# Altium schematic sheet [SH][SW20] V1.0.SchDoc
size A4; PageSetup: Record=PageOptions|CenterHorizontal=True|CenterVertical=True|PrintScale=0.91|XCorrection=1.00|YCorrection=1.00|PrintKind=1|BorderSize=5000000|LeftOffset=0|BottomOffset=0|Orientation=2|PaperLength=3530|PaperWidth=2500|Scale=100|PaperSource=7|PrintQuality=1200|MediaType=1|DitherType=10|PrintScaleMode=1|PaperKind=B4 (ISO)|PaperIndex=42
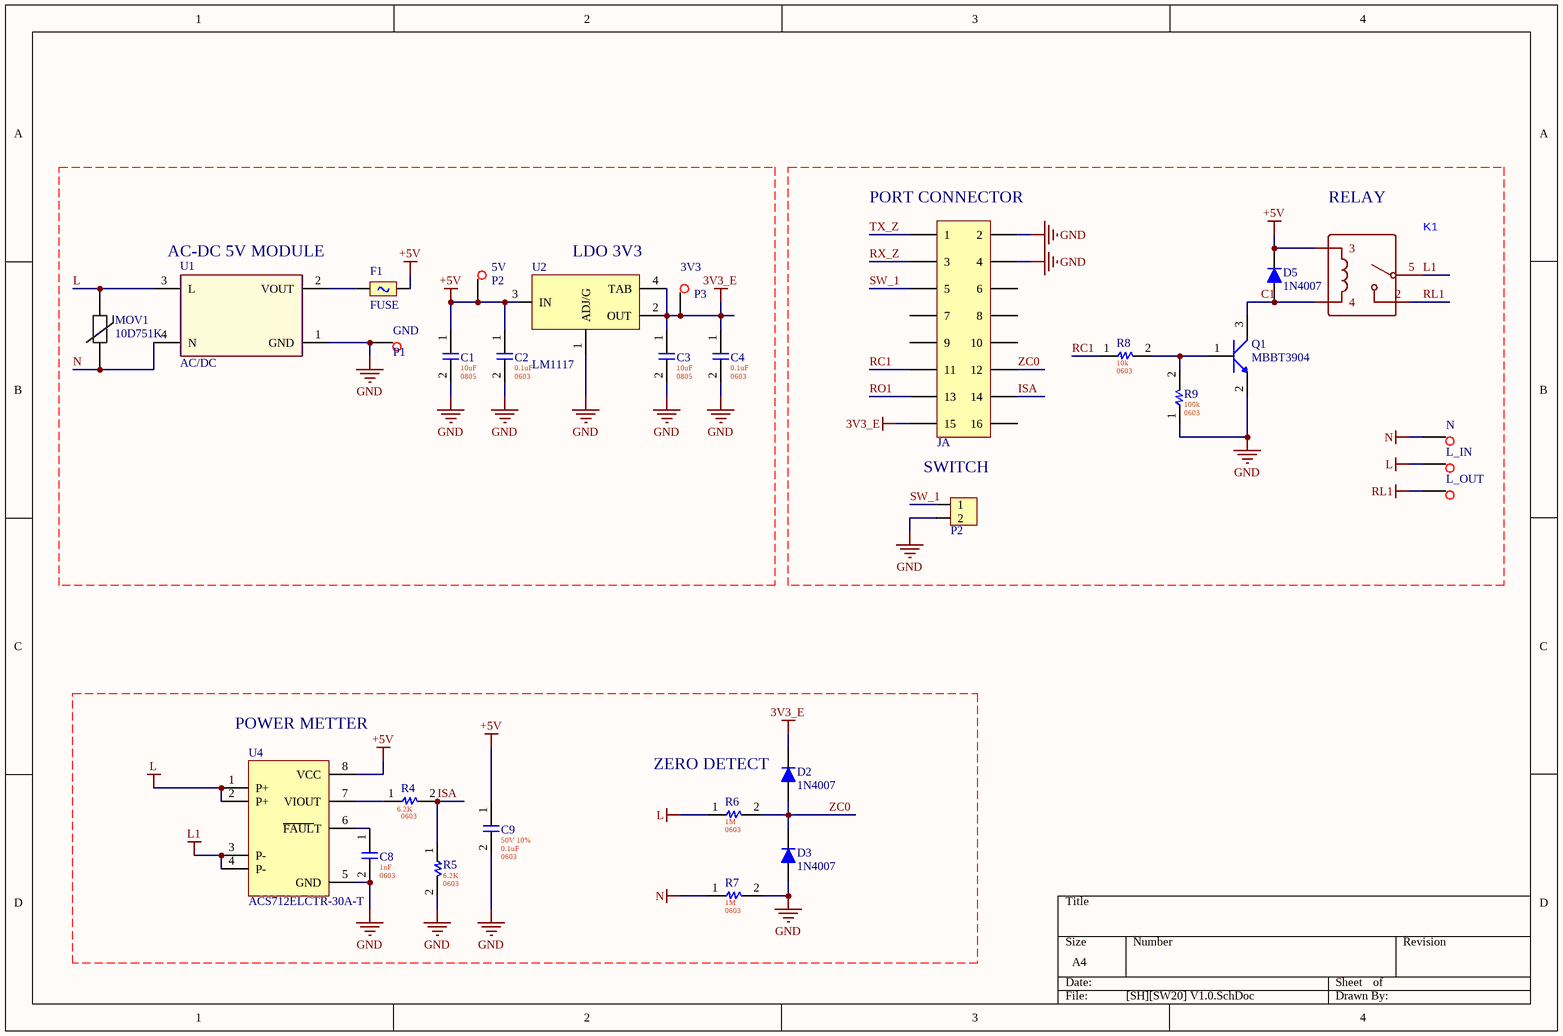
[diagram p0: [SH][SW20] V1.0.SchDoc]

## Parts
3V3  P3  [TEXT_POINT]
5V  P2  [TEXT_POINT]
C1  FP: 0805  [0805 C]  (hidden comment: 10uF)
C2  FP: 0603  [0603 C]  (hidden comment: 0.1uF)
C3  FP: 0805  [0805 C]  (hidden comment: 10uF)
C4  FP: 0603  [0603 C]  (hidden comment: 0.1uF)
C8  FP: 0603  [0603 C]  (hidden comment: 1nF)
C9  VOLTAGE + TOLE: 50V 10%  FP: 0603  [0603 C]  (hidden comment: 0.1uF)
D2  1N4007  [SOD-123]
D3  1N4007  [SOD-123]
D5  1N4007  [DO214AC]
F1  FUSE  [1812]
GND  P1  [TEXT_POINT]
JA  rao doi  [P2X8 - 2.0mm - female - SMD]  (value not drawn)
K1  (no value)  [SLA-5VDC-SL-A]
L_IN  P1  [P1]  (value not drawn)
L_OUT  P1  [P1]  (value not drawn)
MOV1  10D751K  [MOV]
N  P1  [P1]  (value not drawn)
P2  P2  [P2 - 2.54mm]  (value not drawn)
Q1  MBBT3904  [SOT 23-3]
R4  value 6.2K  FP: 0603  [0603 R]  (hidden comment: 8.2k)
R5  value 6.2K  FP: 0603  [0603 R]  (hidden comment: 8.2k)
R6  FP: 0603  [0603 R]  (hidden comment: 1M)
R7  FP: 0603  [0603 R]  (hidden comment: 1M)
R8  FP: 0603  [0603 R]  (hidden comment: 10K)
R9  FP: 0603  [0603 R]  (hidden comment: 100k)
U1  AC/DC  [AC-DC 5V K4H24]
U2  LM1117  [SOT23-4]
U4  ACS712ELCTR-30A-T  [SOIC 8]

## Nets
3V3_E: 3V3.1(P) C3.1 C4.1 D2.2 JA.15 U2.2(OUT) U2.4(TAB)
+5V: 5V.1(P) C1.1 C2.1 C9.1 D5.2 F1.2 K1.3 U2.3(IN) U4.8(VCC)
GND: C1.2 C2.2 C3.2 C4.2 C8.2 C9.2 D3.1 GND.1(P) JA.2 JA.4 P2.2 Q1.2(E) R5.2 R7.2 R9.1 U1.1(GND) U2.1(ADJ/G) U4.5(GND)
L: L_IN.1(P) MOV1.2 R6.1 U1.3(L) U4.1(P+) U4.2(P+)
L1: K1.5 U4.3(P-) U4.4(P-)
N: MOV1.1 N.1(P) R7.1 U1.4(N)
RL1: K1.2 L_OUT.1(P)
C1: D5.1 K1.4 Q1.3(C)
ISA: JA.14 R4.2 R5.1
RC1: JA.11 R8.1
RO1: JA.13
RX_Z: JA.3
SW_1: JA.5 P2.1
TX_Z: JA.1
ZC0: D2.1 D3.2 JA.12 R6.2
NetC8_1: C8.1 U4.6(~{FAUL}T)
NetF1_1: F1.1 U1.2(VOUT)
NetQ1_1: Q1.1(B) R8.2 R9.2
NetR4_1: R4.1 U4.7(VIOUT)

Not connected (* = marked no-connect by the designer): JA 6 7 8 9 10 16

## Notes on the sheet
- (near JA) PORT CONNECTOR
- (near K1) RELAY
- (near U1) AC-DC 5V MODULE
- (near U2) LDO 3V3
- SWITCH
- (near U4) POWER METTER
- ZERO DETECT

## Library data of the parts
3V3 5V = P1
C1 C3 = 0805 10uF CER: CAP CER 10uF 50V 10% 0805 SMD; VOLTAGE + TOLE: 50V 10%; PACKAGE: SMD; DATE: 04-Mar-21; CREATOR: MMUOP; ComponentLink1Description: New link; ComponentLink1URL: *; VALUE: 10uF
C2 C4 = 0603 0.1uF CER: CAP CER 0.1uF 50V 10% 0603 SMD; VOLTAGE + TOLE: 50V 10%; PACKAGE: SMD; DATE: 04-Mar-21; CREATOR: MMUOP; ComponentLink1Description: New link; ComponentLink1URL: *; VALUE: 0.1uF
C8 = 0603 1nF CER: CAP CER 1nF 50V 10% 0603 SMD; VOLTAGE + TOLE: 50V 10%; PACKAGE: SMD; DATE: 04-Mar-21; CREATOR: MMUOP; ComponentLink1Description: New link; ComponentLink1URL: *; VALUE: 1nF
C9 = 0603 0.1uF CER: CAP CER 0.1uF 50V 10% 0603 SMD; PACKAGE: SMD; DATE: 04-Mar-21; CREATOR: MMUOP; ComponentLink1Description: New link; ComponentLink1URL: *; VALUE: 0.1uF
D2 D3 D5 = Diode schottky: PN: *
JA = P2x8
K1 = SLA-5VDC-SL-A_C688869: General Purpose 5VDC SPST-NO Non Latching Through Hole Power Relays ROHS
MOV1 = VARISTOR: 750V
Q1 = TRANS NPN: Bipolar (BJT) Transistor NPN 40 V 200 mA 300MHz 350 mW Surface Mount SOT-23-3 (TO-236)
R4 R5 = 0603 8.2k 1%: 8.2k 1% 0603 SMD; PACKAGE: SMD; DATE: 04-Mar-21; CREATOR: MMUOP; ComponentLink1Description: New link; ComponentLink1URL: *; VOLTAGE + TOLE: 1%
R6 R7 = 0603 1M 1%: 1M 1% 0603 SMD; PACKAGE: SMD; DATE: 04-Mar-21; CREATOR: MMUOP; ComponentLink1Description: New link; ComponentLink1URL: *; VOLTAGE + TOLE: 1%; VALUE: 1M
R8 = 0603 10K 1%: 10k 1% 0603 SMD; PACKAGE: SMD; DATE: 04-Mar-21; CREATOR: MMUOP; ComponentLink1Description: New link; ComponentLink1URL: *; VOLTAGE + TOLE: 1%; VALUE: 10k
R9 = 0603 100K 1%: 100k 1% 0603 SMD; PACKAGE: SMD; DATE: 04-Mar-21; CREATOR: MMUOP; ComponentLink1Description: New link; ComponentLink1URL: *; VOLTAGE + TOLE: 1%; VALUE: 100k
U4 = ACS71240: ACS712ELCTR-20A  SOIC 8; ComponentLink1Description: New link; ComponentLink1URL: https://banlinhkiendientu.vn/acs712t/